# Altium schematic sheet Sheet3.SchDoc
size A4
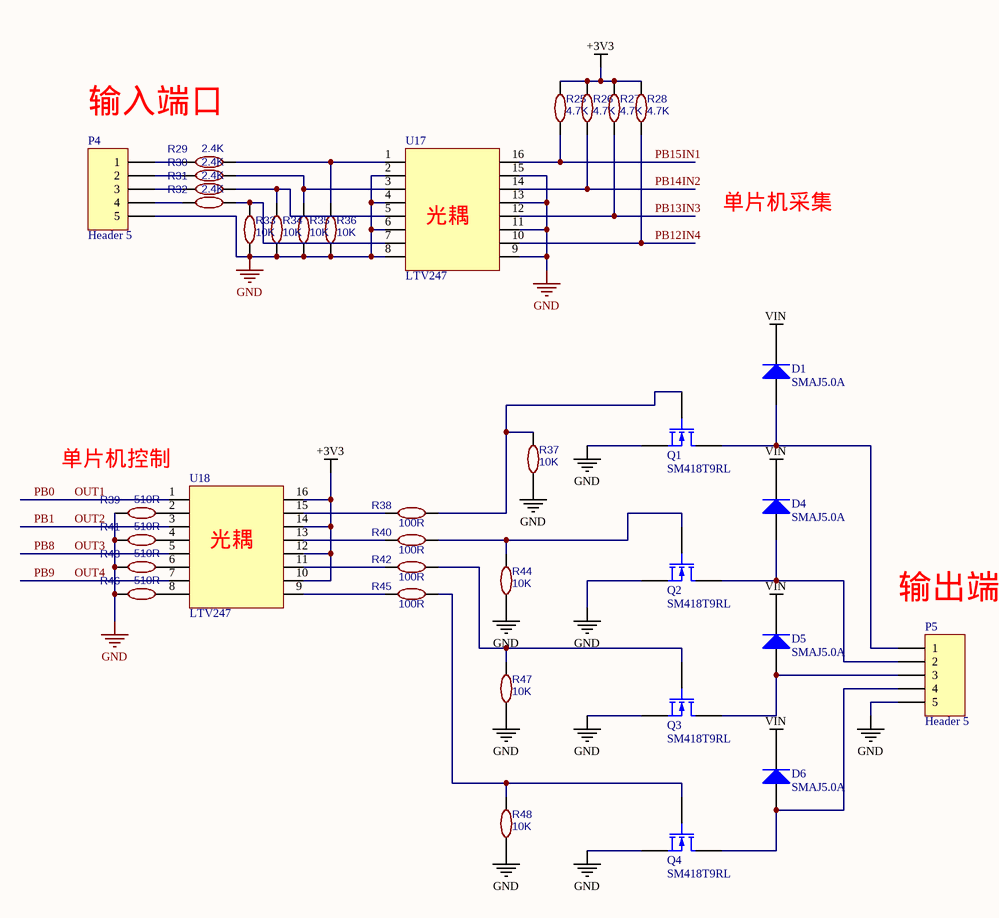
[diagram p0: Sheet3.SchDoc]

## Parts
D1  SMAJ5.0A  [DO214-SMA-SOAC]
D4  SMAJ5.0A  [DO214-SMA-SOAC]
D5  SMAJ5.0A  [DO214-SMA-SOAC]
D6  SMAJ5.0A  [DO214-SMA-SOAC]
P4  Header 5  [HDR1X5]
P5  Header 5  [HDR1X5]
Q1  SM418T9RL  [TO252-3]
Q2  SM418T9RL  [TO252-3]
Q3  SM418T9RL  [TO252-3]
Q4  SM418T9RL  [TO252-3]
R25  4.7K  [R0603]
R26  4.7K  [R0603]
R27  4.7K  [R0603]
R28  4.7K  [R0603]
R29  2.4K  [R0603]
R30  2.4K  [R0603]
R31  2.4K  [R0603]
R32  2.4K  [R0603]
R33  10K  [R0603]
R34  10K  [R0603]
R35  10K  [R0603]
R36  10K  [R0603]
R37  10K  [R0603]
R38  100R  [R0603]
R39  510R  [R0603]
R40  100R  [R0603]
R41  510R  [R0603]
R42  100R  [R0603]
R43  510R  [R0603]
R44  10K  [R0603]
R45  100R  [R0603]
R46  510R  [R0603]
R47  10K  [R0603]
R48  10K  [R0603]
U17  LTV247  [SOIC-16-M]
U18  LTV247  [SOIC-16-M]

## Nets
+3V3: R25.2 R26.2 R27.2 R28.2 U18.10 U18.12 U18.14 U18.16
GND: P4.5 P5.5 Q1.3(S) Q2.3(S) Q3.3(S) Q4.3(S) R33.1 R34.1 R35.1 R36.1 R37.2 R39.1 R41.1 R43.1 R44.2 R46.1 R47.2 R48.2 U17.2 U17.4 U17.6 U17.8 U17.9 U17.11 U17.13 U17.15
VIN: D1.2(K) D4.2(K) D5.2(K) D6.2(K)
IN1: R25.1 U17.16  [also labelled PB15]
IN2: R26.1 U17.14  [also labelled PB14]
IN3: R27.1 U17.12  [also labelled PB13]
IN4: R28.1 U17.10  [also labelled PB12]
OUT1: U18.1  [also labelled PB0]
OUT2: U18.3  [also labelled PB1]
OUT3: U18.5  [also labelled PB8]
OUT4: U18.7  [also labelled PB9]
NetD1_1: D1.1(A) P5.1 Q1.1(D)
NetD4_1: D4.1(A) P5.2 Q2.1(D)
NetD5_1: D5.1(A) P5.3 Q3.1(D)
NetD6_1: D6.1(A) P5.4 Q4.1(D)
NetP4_1: P4.1 R29.1
NetP4_2: P4.2 R30.1
NetP4_3: P4.3 R31.1
NetP4_4: P4.4 R32.1
NetQ1_2: Q1.2(G) R37.1 R38.2
NetQ2_2: Q2.2(G) R40.2 R44.1
NetQ3_2: Q3.2(G) R42.2 R47.1
NetQ4_2: Q4.2(G) R45.2 R48.1
NetR29_2: R29.2 R36.2 U17.1
NetR30_2: R30.2 R35.2 U17.3
NetR31_2: R31.2 R34.2 U17.5
NetR32_2: R32.2 R33.2 U17.7
NetR38_1: R38.1 U18.15
NetR39_2: R39.2 U18.2
NetR40_1: R40.1 U18.13
NetR41_2: R41.2 U18.4
NetR42_1: R42.1 U18.11
NetR43_2: R43.2 U18.6
NetR45_1: R45.1 U18.9
NetR46_2: R46.2 U18.8

## Notes on the sheet
- 输入端口
- (near U17) 光耦
- 单片机采集
- (near R39) 单片机控制
- (near U18) 光耦
- (near P5) 输出端口

## Library data of the parts
D1 D4-D6 = Diode: Default Diode; Published: 8-Jun-2000; LatestRevisionDate: 17-Jul-2002; LatestRevisionNote: Re-released for DXP Platform.; PackageVersion: Sep-1996; PackageReference: SMC; Publisher: Altium Limited; PackageDescription: DO-214-AB/SMC; 2 C-Bend Leads; Body 7.9 x 5.9 mm, inc. leads (LxW); Code_JEDEC: DO-214-AB
P4 P5 = Header 5: Header, 5-Pin 隔离输入输出5P; LatestRevisionDate: 17-Jul-2002; LatestRevisionNote: Re-released for DXP Platform.; Publisher: Altium Limited
Q1-Q4 = MOSFET-N: N-Channel MOSFET; Published: 8-Jun-2000; LatestRevisionDate: 17-Jul-2002; LatestRevisionNote: Re-released for DXP Platform.; PackageVersion: 1995/1996; PackageReference: E3; Publisher: Altium Limited; PackageDescription: TO, Flat Index; 3 In-Line, Axial Leads; Body Dia. 4.6mm; Lead Dia. 0.5 mm (max)
R25-R48 = 1K: BOM_Manufacturer: UniOhm; BOM_Manufacturer Part: 0603WAF1001T5E; nameAlias: Resistance (Ohms); SMT Type: Basic; BOM_Supplier: LCSC; BOM_Supplier Part: C21190; BOM_JLCPCB SMD: Yes; spicePre: R; spiceSymbolName: 0603WAF1001T5E
U17 U18 = SOP-16: 光耦